# EasyEDA Pro project ProPrj_Gardening IoT_2026-04-28.epro

# Schematic Gardening IoT
Board Name: Gardening IoT; Create Date: 2023-11-24; Page Name: Sheet_1; Project Name: Gardening IoT; Schematic Name: Gardening IoT; Update Date: 2026-01-17; Add into BOM: yes; Company: Your Company; Convert to PCB: yes; Date: 2023-11-09; Draw By: respireengineer; REV: 1.0; Sheet: 1/1
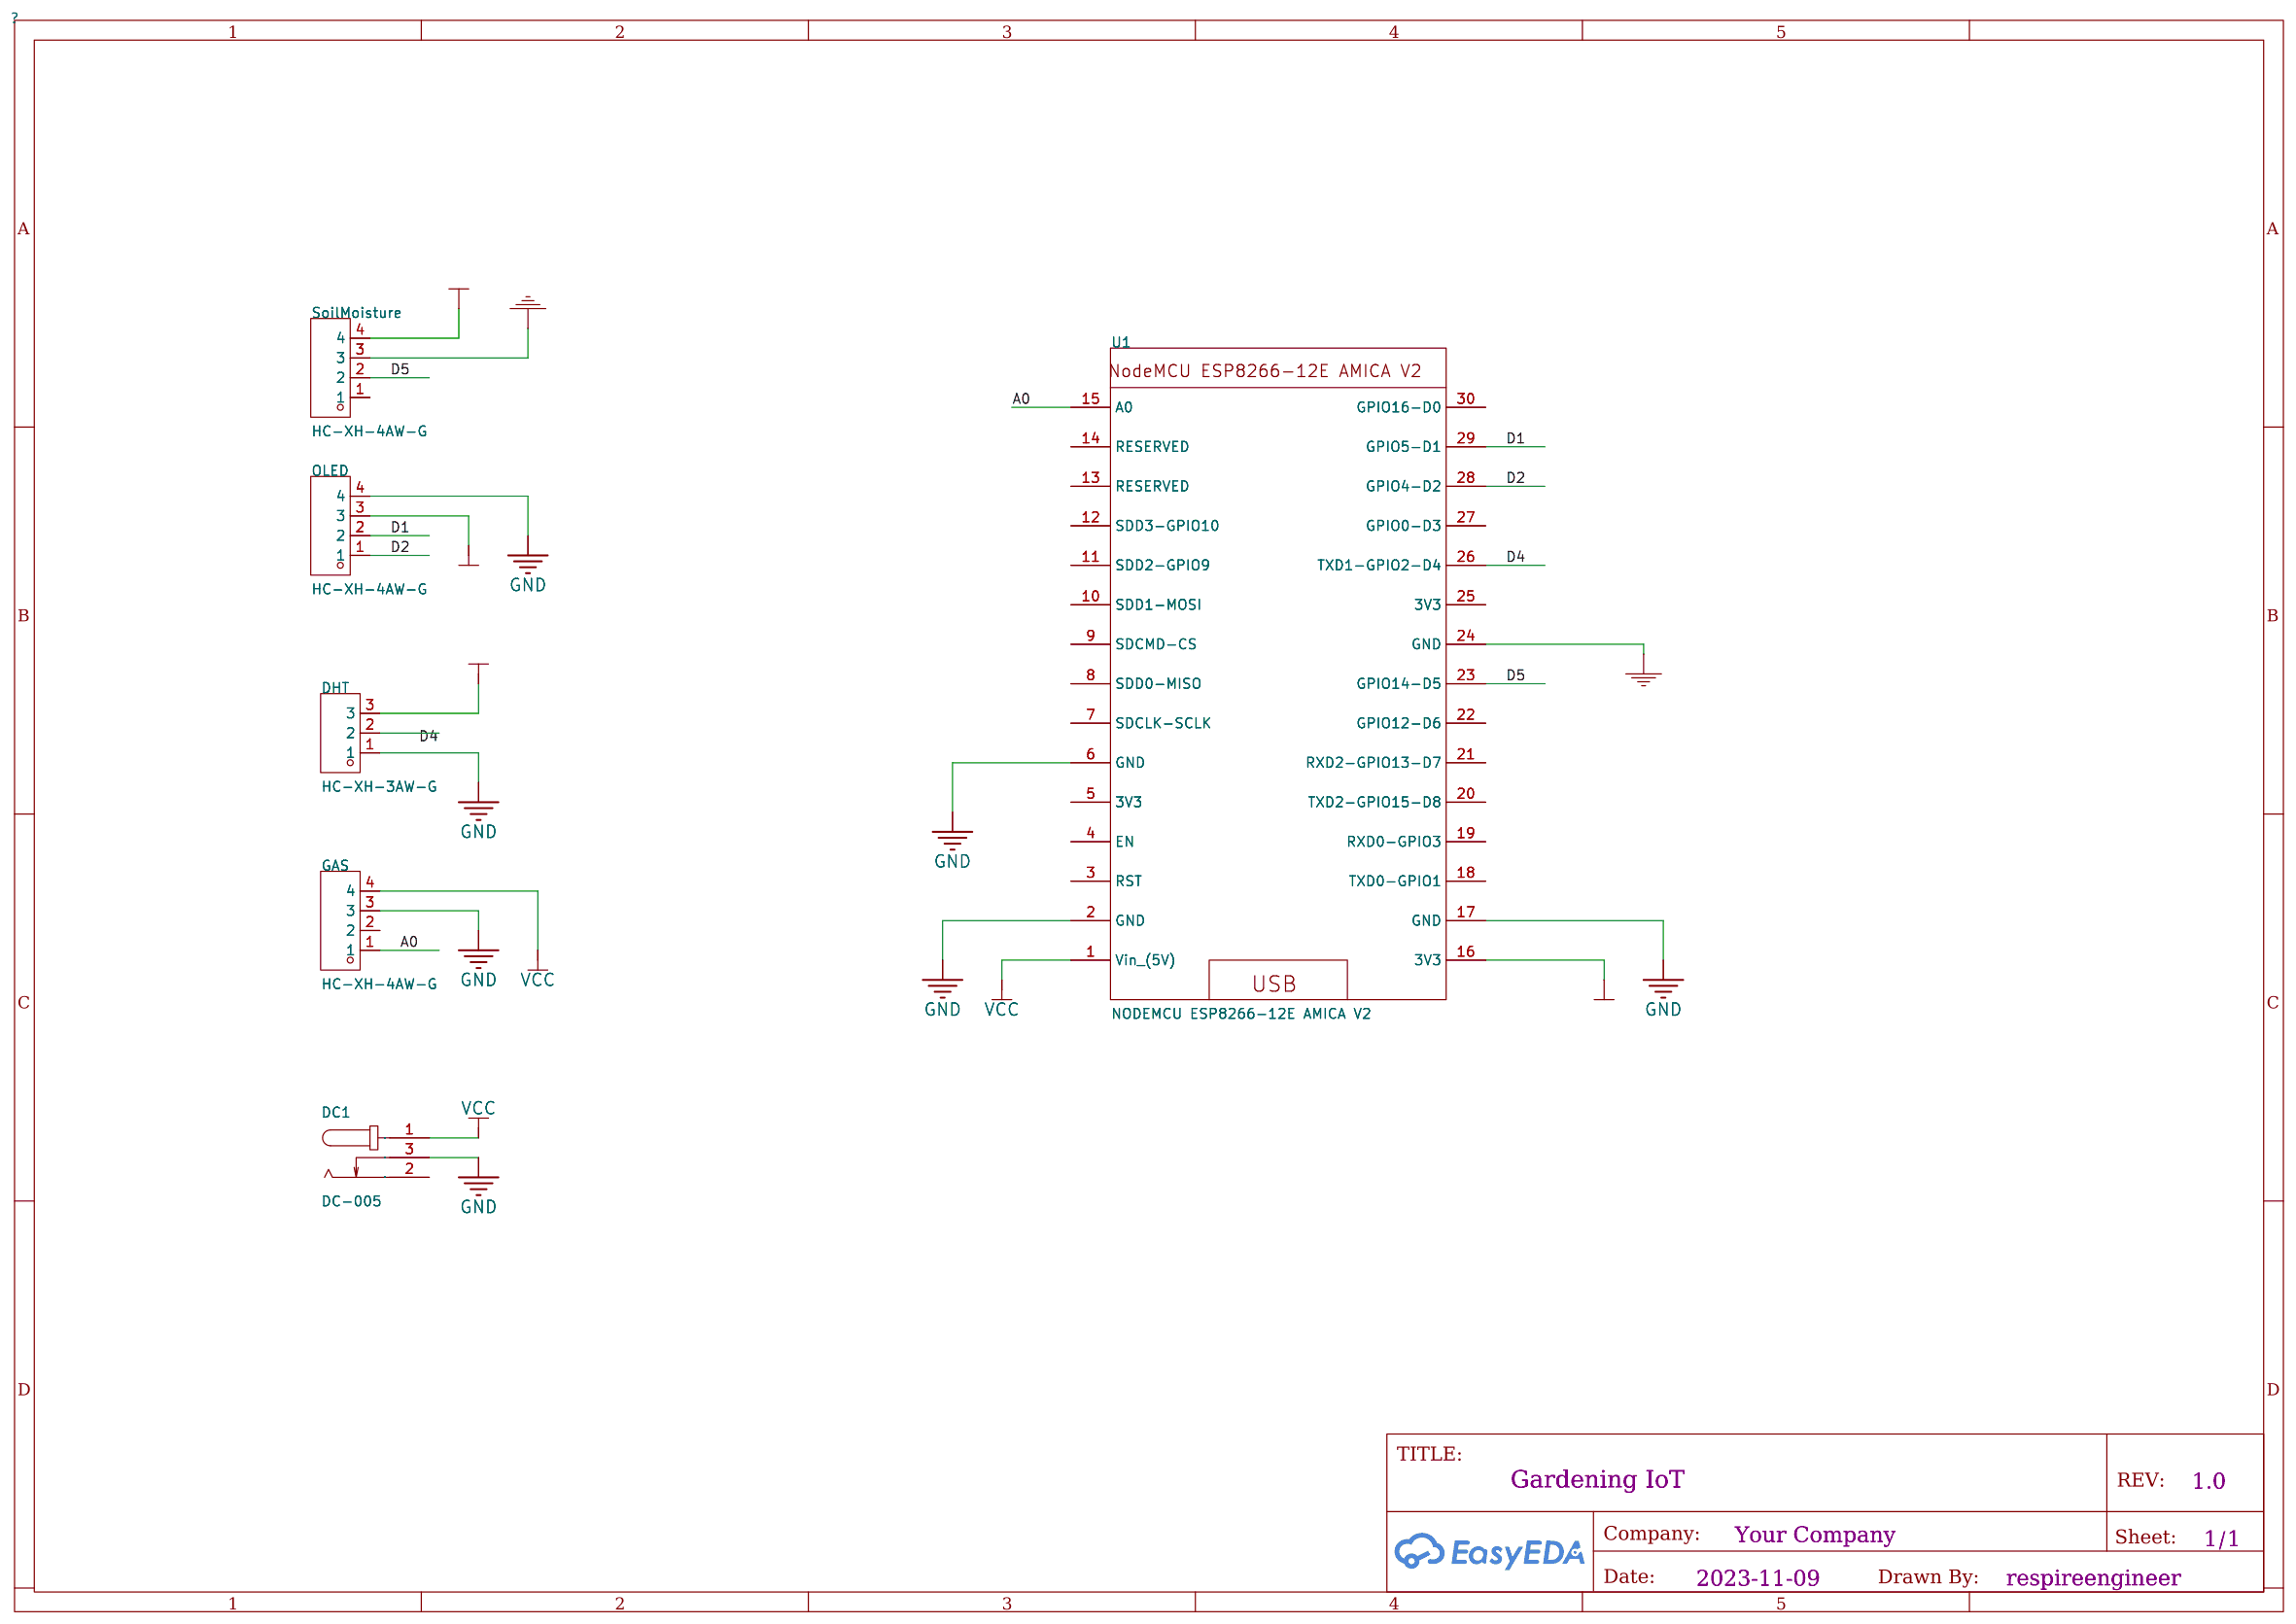
[diagram p0: schematic sheet]

## Parts
DC1  DC-005  [DC-IN-TH_DC-005-A]
DHT  HC-XH-3AW-G  [CONN-TH_3P-P2.50_HC-XH-3AW-G]
GAS  HC-XH-4AW-G  [CONN-TH_4P-P2.50_HC-XH-4AW-G]
OLED  HC-XH-4AW-G  [CONN-TH_4P-P2.50_HC-XH-4AW-G]
SoilMoisture  HC-XH-4AW-G  [CONN-TH_4P-P2.50_HC-XH-4AW-G]
U1  NODEMCU ESP8266-12E AMICA V2  [NODEMCU ESP8266-12E AMICA V2]

## Library data of the parts
DC1 = DC-005: Supplier Part: C9900004933; Supplier Footprint: DC-IN-TH_3P-L14.2-W8.8-P4.80; JLCPCB Part Class: Extended Part; Supplier: LCSC
DHT = HC-XH-3AW-G: Pins Structure:1x3P Pitch:2.5mm Mounting Type:Right Angle Reference Series:XH Number of Pins:3P Number of Rows:1 Number of PINs Per Row:3 Row Spacing:- Current Rating:3A Contact Material:Brass Contact Plating:Tin Operating Temperature:-25℃~+85℃ Operating; LCSC Part Name: 1x3P 间距:2.5mm 弯插 系列:XH; Supplier Part: C5341209; Manufacturer: HCTL(华灿天禄); Supplier Footprint: 弯插,P=2.5mm; JLCPCB Part Class: Extended Part; Datasheet: https://item.szlcsc.com/datasheet/HC-XH-3AW-G/6113100.html; Supplier: LCSC; Pins Structure: 1x3P; Pitch: 2.5mm; Mounting Type: Right Angle; Reference Series: XH; Number of Pins: 3P; Number of Rows: 1; Number of PINs Per Row: 3; Current Rating: 3A; Contact Material: Brass; Contact Plating: Tin; Operating Temperature: -25℃~+85℃; Voltage Rating: 250V; Plastic Material: PA66; Flame Retardant Rating: UL94V-0; Color: White; Z-Height of the Board: 5.9mm; X-Length of Bottom Edge on Board (Spacing Line): 10mm; Y-Width of Bottom Edge on Board: 7.32mm
GAS OLED SoilMoisture = HC-XH-4AW-G: Pins Structure:1x4P Pitch:2.5mm Mounting Style:Bend insert Reference Series:XH Number of Pins:4P Number of Rows:1 Number of PINs Per Row:4 Row Spacing:- Current Rating (Max):3A Contact Material:Brass Contact Plating:Tin Operating Temperature Range:-25℃~+8; LCSC Part Name: 1x4P 间距:2.5mm 弯插 系列:XH; Supplier Part: C5341210; Manufacturer: HCTL(华灿天禄); Supplier Footprint: 弯插,P=2.5mm; JLCPCB Part Class: Extended Part; Datasheet: https://atta.szlcsc.com/upload/public/pdf/source/20240528/1CB06E5B1FB43CB241534AB2AE6D95F8.pdf; Supplier: LCSC; Pins Structure: 1x4P; Pitch: 2.5mm; Mounting Style: Bend insert; Reference Series: XH; Number of Pins: 4P; Number of Rows: 1; Number of PINs Per Row: 4; Current Rating (Max): 3A; Contact Material: Brass; Contact Plating: Tin; Operating Temperature Range: -25℃~+85℃; Rated Voltage (Max): 250V; Plastic Material: PA66; Flame Retardant Rating: UL94V-0; Colour: White; Z-Height of the Board: 5.9mm; X-Length of Bottom Edge on Board (Spacing Line): 12.5mm; Y-Width of Bottom Edge on Board: 7.32mm
U1 = NODEMCU ESP8266-12E AMICA V2: NodeMCU Lua Amica Module V2 ESP8266 ESP-12F WIFI Wifi Development Board avec CP2102; Supplier Part: NodeMCU Lua Amica Module V2 ESP8266 ESP-12F WIFI Wifi Development Board avec CP2102; Manufacturer: AZ-Delivery; Manufacturer Part: NodeMCU Lua Amica Module V2 ESP8266 ESP-12F WIFI Wifi Development Board avec CP2102; Supplier: AZ-Delivery; Product Link: https://www.az-delivery.de/fr/products/nodemcu

## Nets
GND: DC1.3 DHT.1 GAS.3 OLED.4 SoilMoisture.3 U1.2(GND) U1.6(GND) U1.17(GND) U1.24(GND)
VCC: DC1.1 GAS.4 U1.1(Vin (5V))
VCC2: DHT.3 OLED.3 SoilMoisture.4 U1.16(3V3)
A0: GAS.1 U1.15(A0)
D1: OLED.2 U1.29(GPIO5-D1)
D2: OLED.1 U1.28(GPIO4-D2)
D4: DHT.2 U1.26(TXD1-GPIO2-D4)
D5: SoilMoisture.2 U1.23(GPIO14-D5)

Not connected (* = marked no-connect by the designer): DC1 2; GAS 2; SoilMoisture 1; U1 3(RST) 4(EN) 5(3V3) 7(SDCLK-SCLK) 8(SDD0-MISO) 9(SDCMD-CS) 10(SDD1-MOSI) 11(SDD2-GPIO9) 12(SDD3-GPIO10) 13(RESERVED) 14(RESERVED) 18(TXD0-GPIO1) 19(RXD0-GPIO3) 20(TXD2-GPIO15-D8) 21(RXD2-GPIO13-D7) 22(GPIO12-D6) 25(3V3) 27(GPIO0-D3) 30(GPIO16-D0)

# Board PCB3
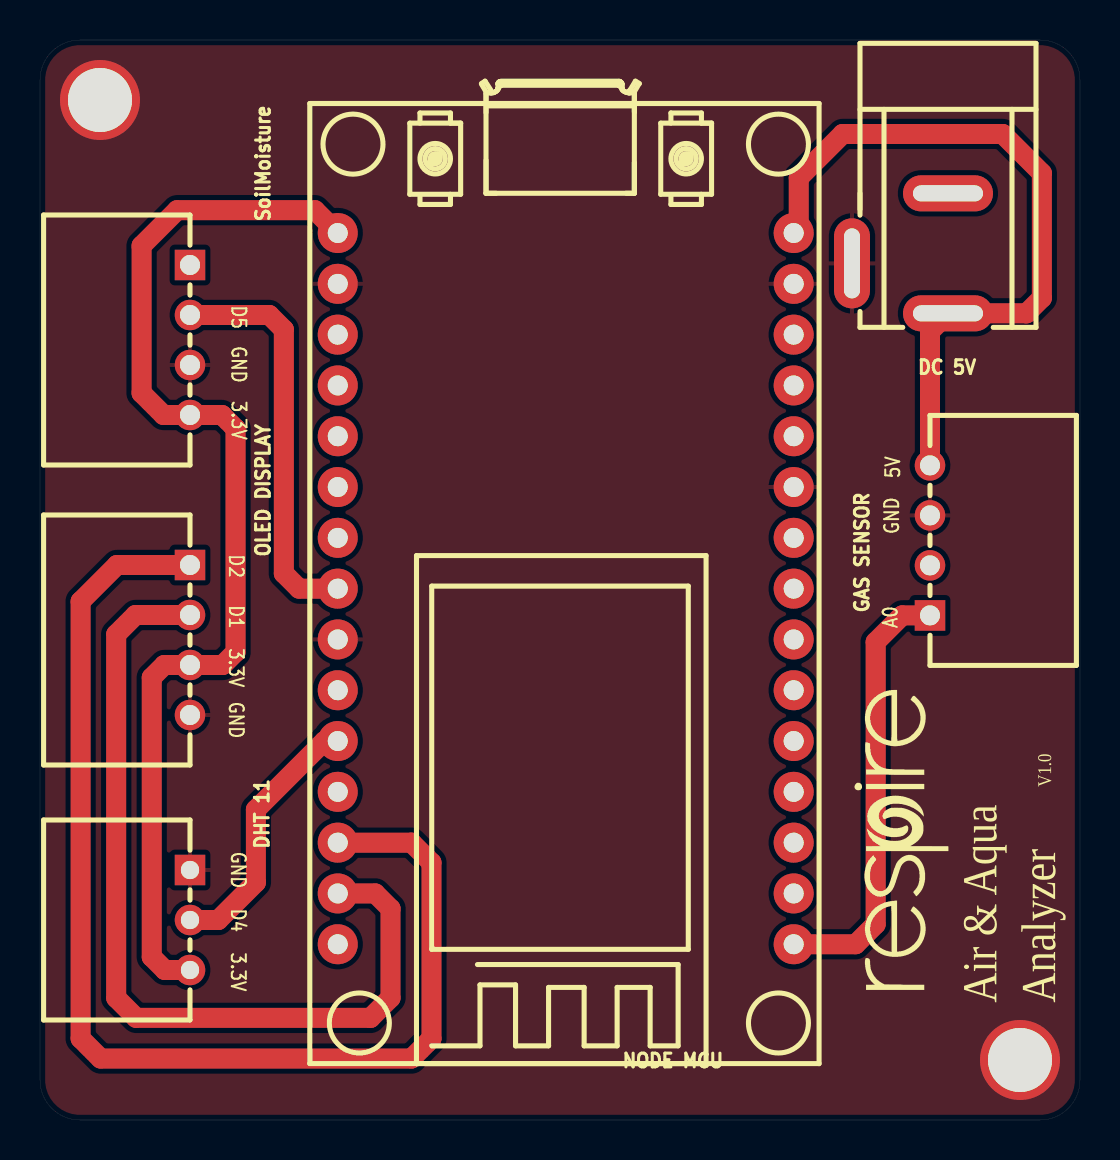
[diagram p1: board, top side]
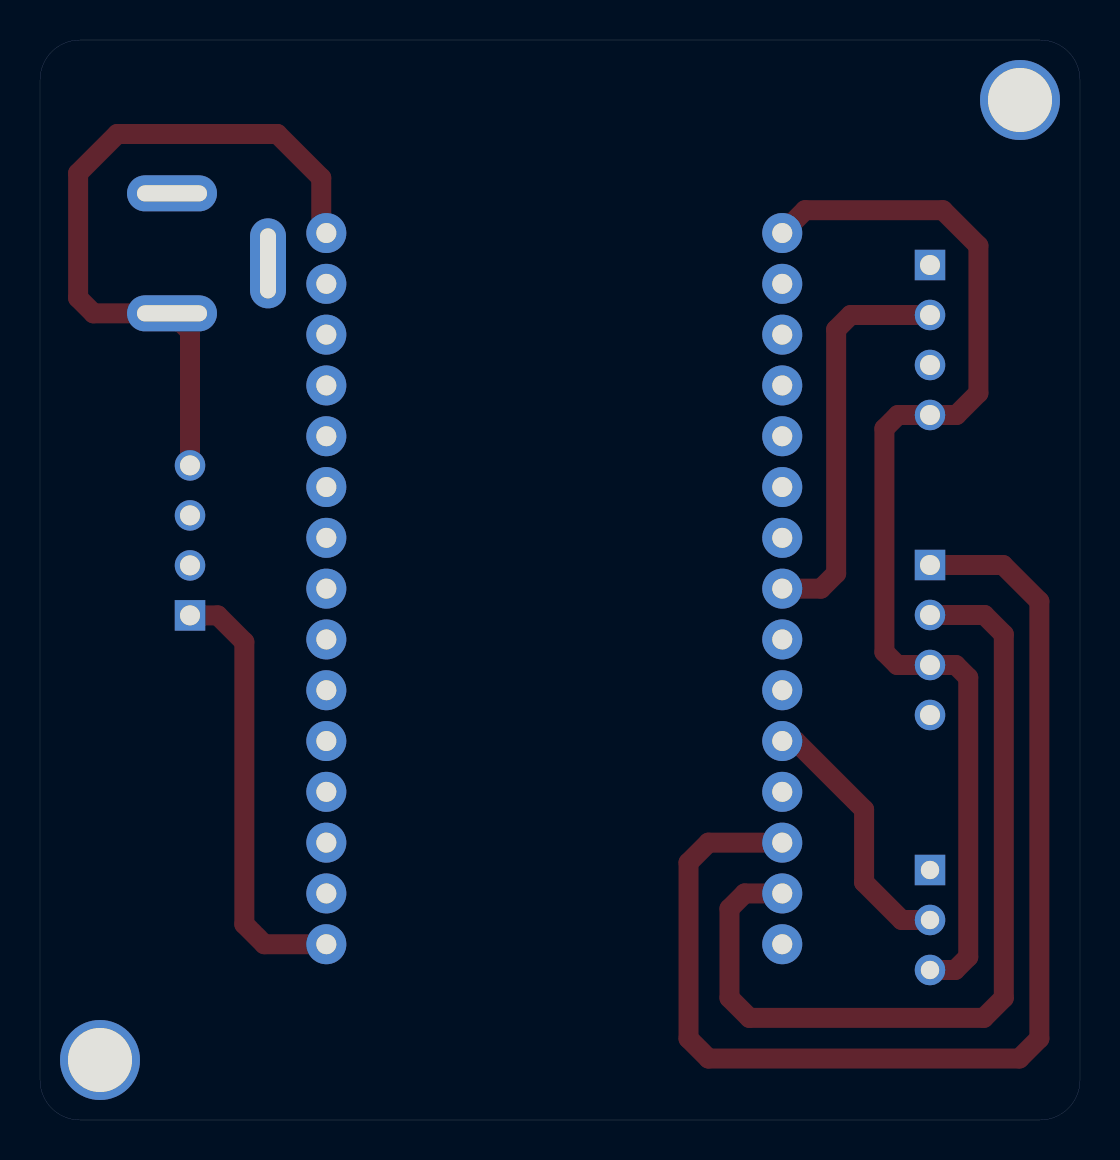
[diagram p2: board, bottom side, seen from below]

Outline 52 x 54 mm; copper layers: Top Layer, Bottom Layer. Coordinates in mm from the lower left corner of the outline.
Outline path: 0,52 0,2 arc(0.59,0.59) 2,0 50,0 arc(51.41,0.59) 52,2 52,52 arc(51.41,53.41) 50,54 2,54 arc(0.59,53.41) 0,52
Stack: Top Layer 0.035mm / Dielectric1 1.51mm FR4 er 4.5 / Bottom Layer 0.035mm

## Design rules (mm)
template: Custom Config
spacing copperThickness1oz (default): track to track 0.102, other pairs 0.152 to 0.3
spacing copperThickness2oz: track to track 0.203, other pairs 0.152 to 0.3
track width copperThickness1oz (default): min 0.127, default 1, max 2.54
track width copperThickness2oz: min 0.203, default 0.254, max 2.54
differential pair differentialPair (default): width min 0.127, default 0.254, max 2.54; gap min 0.152, default 0.152
via viaSize (default): diameter min 0.5, default 0.61, max 10; hole min 0.3, default 0.305, max 6.3

## Placement (name value [footprint] x y rotation side)
DC 5V  DC-005  [DC-IN-TH_DC-005-A]  43 43.33 270 top
DHT 11  HC-XH-3AW-G  [CONN-TH_3P-P2.50_HC-XH-3AW-G]  7.5 10 270 top
GAS SENSOR  HC-XH-4AW-G  [CONN-TH_4P-P2.50_HC-XH-4AW-G]  44.5 28.98 90 top
NODE MCU  -  [NODEMCU ESP8266-12E AMICA V2]  25.75 24.03 180 top
NOREF  -  [Pad_e455]  3 51 0 top
NOREF#2  -  [Pad_e456]  49 3 0 top
OLED DISPLAY  HC-XH-4AW-G  [CONN-TH_4P-P2.50_HC-XH-4AW-G]  7.5 24 270 top
SoilMoisture  HC-XH-4AW-G  [CONN-TH_4P-P2.50_HC-XH-4AW-G]  7.5 39 270 top

## Footprints (pads in the part's own frame, mm; a bottom-side part is the same pattern mirrored in y, then rotated)
CONN-TH_3P-P2.50_HC-XH-3AW-G
  rect 1.524x1.524 hole 0.914: 1(-2.5,0)
  round 1.524 hole 0.914: 2(0,0) 3(2.5,0)
CONN-TH_4P-P2.50_HC-XH-4AW-G
  rect 1.524x1.524 hole 1: 1(-3.75,0)
  round 1.524 hole 1: 2(-1.25,0) 3(1.25,0) 4(3.75,0)
DC-IN-TH_DC-005-A
  oval 1.8x4.5 hole 0.8x3.5: 1(3,2.4) 2(-3,2.4)
  oval 4.5x1.8 hole 3.5x0.8: 3(0.5,-2.4)
NODEMCU ESP8266-12E AMICA V2
  round 2 hole 1: 1(-11.938,-20.32) 2(-11.938,-17.78) 3(-11.938,-15.24) 4(-11.938,-12.7) 5(-11.938,-10.16) 6(-11.938,-7.62) 7(-11.938,-5.08) 8(-11.938,-2.54) 9(-11.938,0) 10(-11.938,2.54) 11(-11.938,5.08) 12(-11.938,7.62) 13(-11.938,10.16) 14(-11.938,12.7) 15(-11.938,15.24) 16(10.858,-20.32) 17(10.858,-17.78) 18(10.858,-15.24) 19(10.858,-12.7) 20(10.858,-10.16) 21(10.858,-7.62) 22(10.858,-5.08) 23(10.858,-2.54) 24(10.858,0) 25(10.858,2.54) 26(10.858,5.08) 27(10.858,7.62) 28(10.858,10.16) 29(10.858,12.7) 30(10.858,15.24)
Pad_e455
  round 4 hole 3.2: 1(0,0)
Pad_e456
  round 4 hole 3.2: 2(0,0)

## Nets
GND: DC 5V.3 DHT 11.1 GAS SENSOR.3 NODE MCU.2 NODE MCU.6 NODE MCU.17 NODE MCU.24 NOREF.1 NOREF#2.2 OLED DISPLAY.4 SoilMoisture.3
VCC: DC 5V.1 GAS SENSOR.4 NODE MCU.1
VCC2: DHT 11.3 NODE MCU.16 OLED DISPLAY.3 SoilMoisture.4
A0: GAS SENSOR.1 NODE MCU.15
D1: NODE MCU.29 OLED DISPLAY.2
D2: NODE MCU.28 OLED DISPLAY.1
D4: DHT 11.2 NODE MCU.26
D5: NODE MCU.23 SoilMoisture.2

Pads without a net: DC 5V 2; GAS SENSOR 2; NODE MCU 3 4 5 7 8 9 10 11 12 13 14 18 19 20 21 22 25 27 30; SoilMoisture 1

## Routing (per net, layer and track width the routed paths; a pad name or vN(x,y) marks a point on that pad's centre or on a via; arc(x,y) is an arc through that point)
VCC: length 35.9
  Top Layer w1: GAS SENSOR.4 44.5,39.43 DC 5V.1 49.32,40.33 50.09,41.1 50.09,47.34 48.13,49.3 40.13,49.3 37.94,47.11 37.94,44.35
VCC2: length 55.9
  Top Layer w1: NODE MCU.16 13.74,45.49 6.86,45.49 5.08,43.71 5.08,36.35 6.18,35.25 SoilMoisture.4 9.1,35.25 9.78,34.57 9.78,23.39 9.14,22.75 OLED DISPLAY.3 6.22,22.75 5.59,22.12 5.59,8.15 6.24,7.5 DHT 11.3
A0: length 21.9
  Top Layer w1: GAS SENSOR.1 43.11,25.23 41.78,23.9 41.78,9.79 40.78,8.79 NODE MCU.15
D1: length 44.2
  Top Layer w1: NODE MCU.29 16.76,11.33 17.53,10.57 17.53,6.11 16.53,5.1 4.81,5.1 3.81,6.11 3.81,24.28 4.78,25.25 OLED DISPLAY.2
D2: length 60.3
  Top Layer w1: OLED DISPLAY.1 3.85,27.75 2.03,25.93 2.03,4.07 3.03,3.07 18.57,3.07 19.57,4.07 19.57,12.87 18.57,13.87 NODE MCU.28
D4: length 13.2
  Top Layer w1: NODE MCU.26 14.22,18.95 10.79,15.52 10.79,11.88 8.91,10 DHT 11.2
D5: length 20.5
  Top Layer w1: SoilMoisture.2 11.46,40.25 12.19,39.52 12.19,27.33 12.95,26.57 15.14,26.57

## Copper pours and planes (outline as drawn; the poured copper is in the pictures)
GND on Top Layer: 0,54 52.07,54 52.07,-0.1 0,-0.1

## Text on the board
Top Silkscreen Layer: D2 | D1 | 3.3V | GND | D4 | D5 | A0 | 5V | V1.0 | Air & Aqua / Analyzer

# Board PCB_Gardening IoT
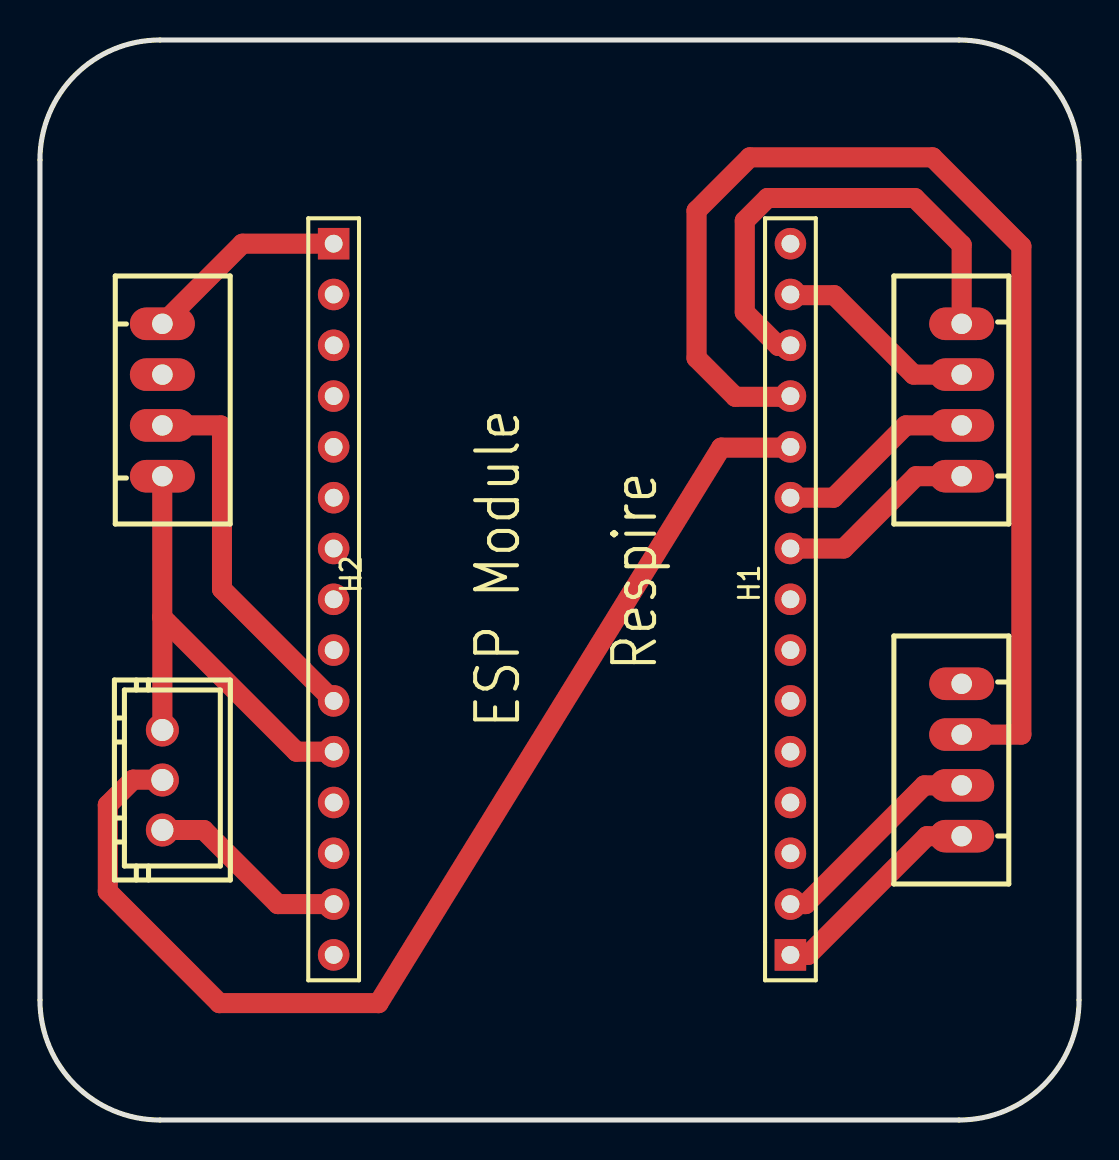
[diagram p3: board, top side]
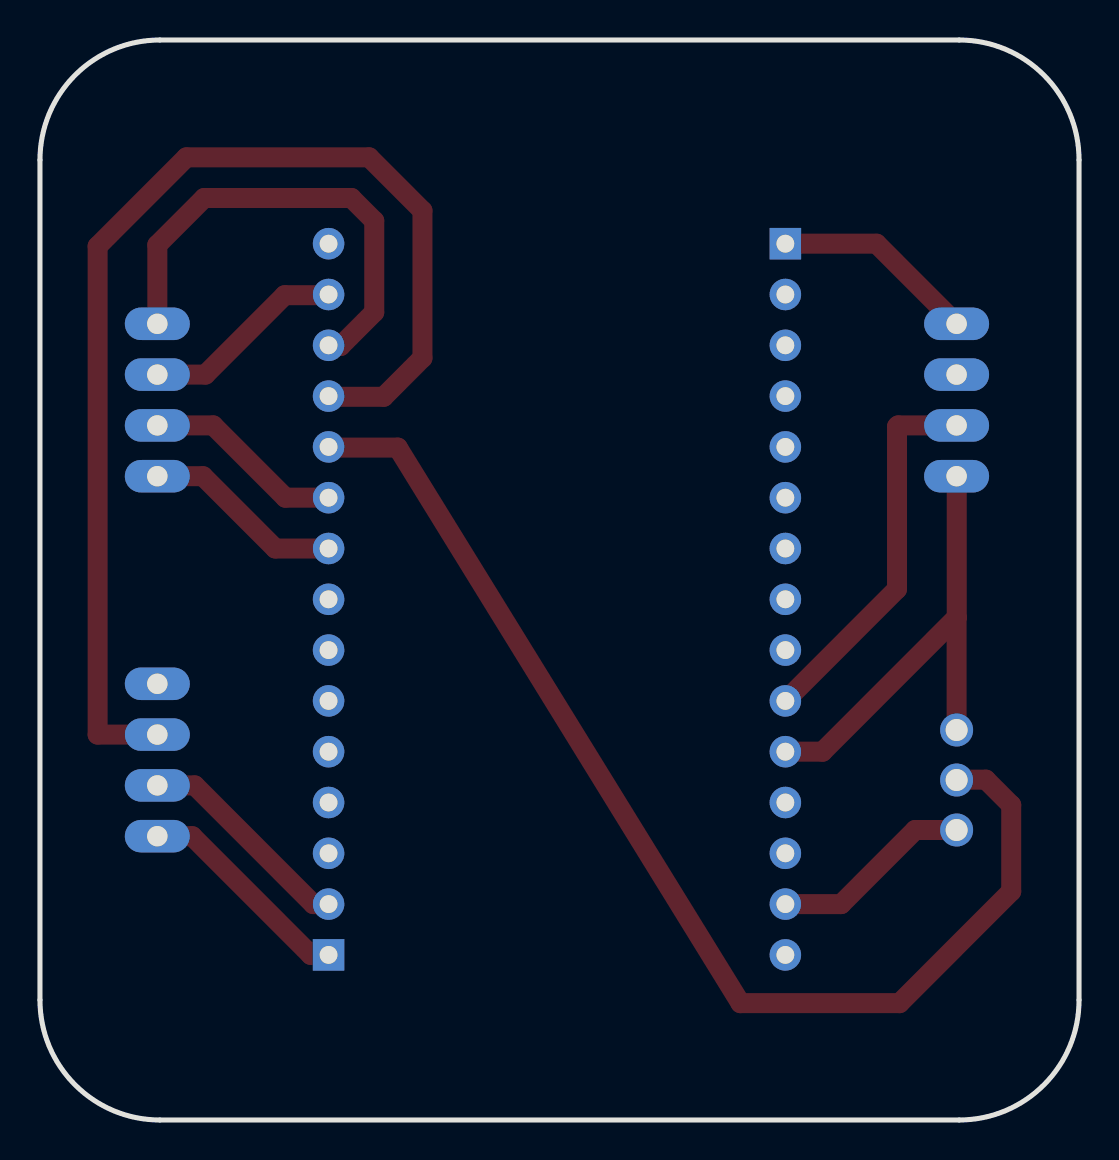
[diagram p4: board, bottom side, seen from below]

Outline 52 x 54 mm; copper layers: Top Layer, Bottom Layer. Coordinates in mm from the lower left corner of the outline.
Outline path: 0,48 arc(1.76,52.24) 6,54 46,54 arc(50.24,52.24) 52,48 52,6 arc(50.24,1.76) 46,0 6,0 arc(1.76,1.76) 0,6 0,48
Stack: Top Layer 0.035mm / Dielectric1 1.51mm FR4 er 4.5 / Bottom Layer 0.035mm

## Design rules (mm)
spacing Default (default): track to track 0.152, other pairs 0 to 0.152
track width Default (default): min 0.254, default 0.254, max 25.4
differential pair differentialPair (default): width min 0.127, default 0.254, max 2.54; gap min 0.152, default 0.152
via Default (default): diameter min 0.61, default 0.61, max 100.025; hole min 0.305, default 0.305, max 59.995

## Placement (name value [footprint] x y rotation side)
H1  HDR-F-2.54_1x15  [HDR-F-2.54_1X15]  37.56 26.03 90 top
H2  HDR-F-2.54_1x15  [HDR-F-2.54_1X15]  14.7 26.03 270 top
U3  OLED Display  [JST-XH-04]  46.13 36 90 top
U4  Gas  [JST-XH-04]  46.13 18 90 top
U5  Soil Moisture  [JST-XH-04]  6.13 36 270 top
U6  Humidity Sensor  [CONN-TH_XH2.54-3P]  6.13 17 90 top

## Footprints (pads in the part's own frame, mm; a bottom-side part is the same pattern mirrored in y, then rotated)
CONN-TH_XH2.54-3P
  round 1.65 hole 1.1: 1(-2.5,0) 2(-0.001,0) 3(2.5,0)
HDR-F-2.54_1X15
  rect 1.575x1.575 hole 0.889: 1(-17.78,0)
  round 1.575 hole 0.889: 2(-15.24,0) 3(-12.7,0) 4(-10.16,0) 5(-7.62,0) 6(-5.08,0) 7(-2.54,0) 8(0,0) 9(2.54,0) 10(5.08,0) 11(7.62,0) 12(10.16,0) 13(12.7,0) 14(15.24,0) 15(17.78,0)
JST-XH-04
  oval 1.625x3.251 hole 1.016x1.021: 1(-3.81,0) 2(-1.27,0) 3(1.27,0) 4(3.81,0)

## Nets
GND: H2.10 U5.3
GND1: H1.9 U3.1
GND2: H1.2 U4.2
GND3: H2.14 U6.1
VCC1: H1.10 U3.2
VCC2: H1.1 U4.1
VCC5: H2.11 U5.4 U6.3
H1_3: H1.3
H1_4: H1.4
H1_5: H1.5
H1_6: H1.6
H1_7: H1.7
H1_8: H1.8
H1_15: H1.15
H2_2: H2.2
H2_3: H2.3
H2_4: H2.4
H2_5: H2.5
H2_6: H2.6
H2_7: H2.7
H2_8: H2.8
H2_9: H2.9
H2_12: H2.12
H2_13: H2.13
H2_15: H2.15
U3_3: H1.14 U3.3
U3_4: H1.13 U3.4
U4_3: H1.12 U4.3
U4_4: U4.4
U5_1: H2.1 U5.1
U5_2: U5.2
U6_2: H1.11 U6.2

## Routing (per net, layer and track width the routed paths; a pad name or vN(x,y) marks a point on that pad's centre or on a via; arc(x,y) is an arc through that point)
GND: length 19
  Top Layer w1: H2.10 9.11,26.54 9.11,34.67 9.05,34.73 U5.3
GND1: length 10.1
  Top Layer w1: U3.1 43.84,32.19 40.22,28.58 H1.9
GND2: length 11
  Top Layer w1: H1.2 38.32,10.8 44.25,16.73 46.13,16.73
GND3: length 10.1
  Top Layer w1: U6.1 8.2,14.5 11.9,10.8 H2.14
VCC1: length 10.1
  Top Layer w1: U3.2 43.33,34.73 39.72,31.11 H1.10
VCC2: length 11
  Top Layer w1: 46.13,14.19 44.38,14.19 38.45,8.25 H1.1
VCC5: length 24
  Top Layer w1: 14.7,18.42 12.84,18.42 6.13,25.12 ; U5.4 6.12,32.18 6.12,25.13 6.13,25.12 ; 6.13,25.12 U6.3
U3_3: length 10.2
  Top Layer w1: U3.3 43.72,37.27 39.75,41.24 37.56,41.24
U3_4: length 23.9
  Top Layer w0.254: U3.4 46.07,39.75
  Top Layer w1: U3.4 46.13,43.75 43.78,46.1 36.41,46.1 35.27,44.96 35.27,40.39 36.96,38.7 37.56,38.7
U4_3: length 59.5
  Top Layer w1: U4.3 49.11,19.27 49.11,43.69 44.67,48.13 35.52,48.13 32.86,45.47 32.86,38.1 34.8,36.16 37.56,36.16
U5_1: length 10.2
  Top Layer w1: H2.1 10.13,43.81 U5.1
U6_2: length 59.6
  Top Layer w1: 37.56,33.62 34.09,33.62 16.94,5.84 8.98,5.84 3.39,11.43 3.39,15.75 4.66,17.02 6.13,17.02 U6.2

## Text on the board
Top Silkscreen Layer: ESP Module | Respire
